# EAGLE design roomba_wall_v2_d (EAGLE 7.6.0)
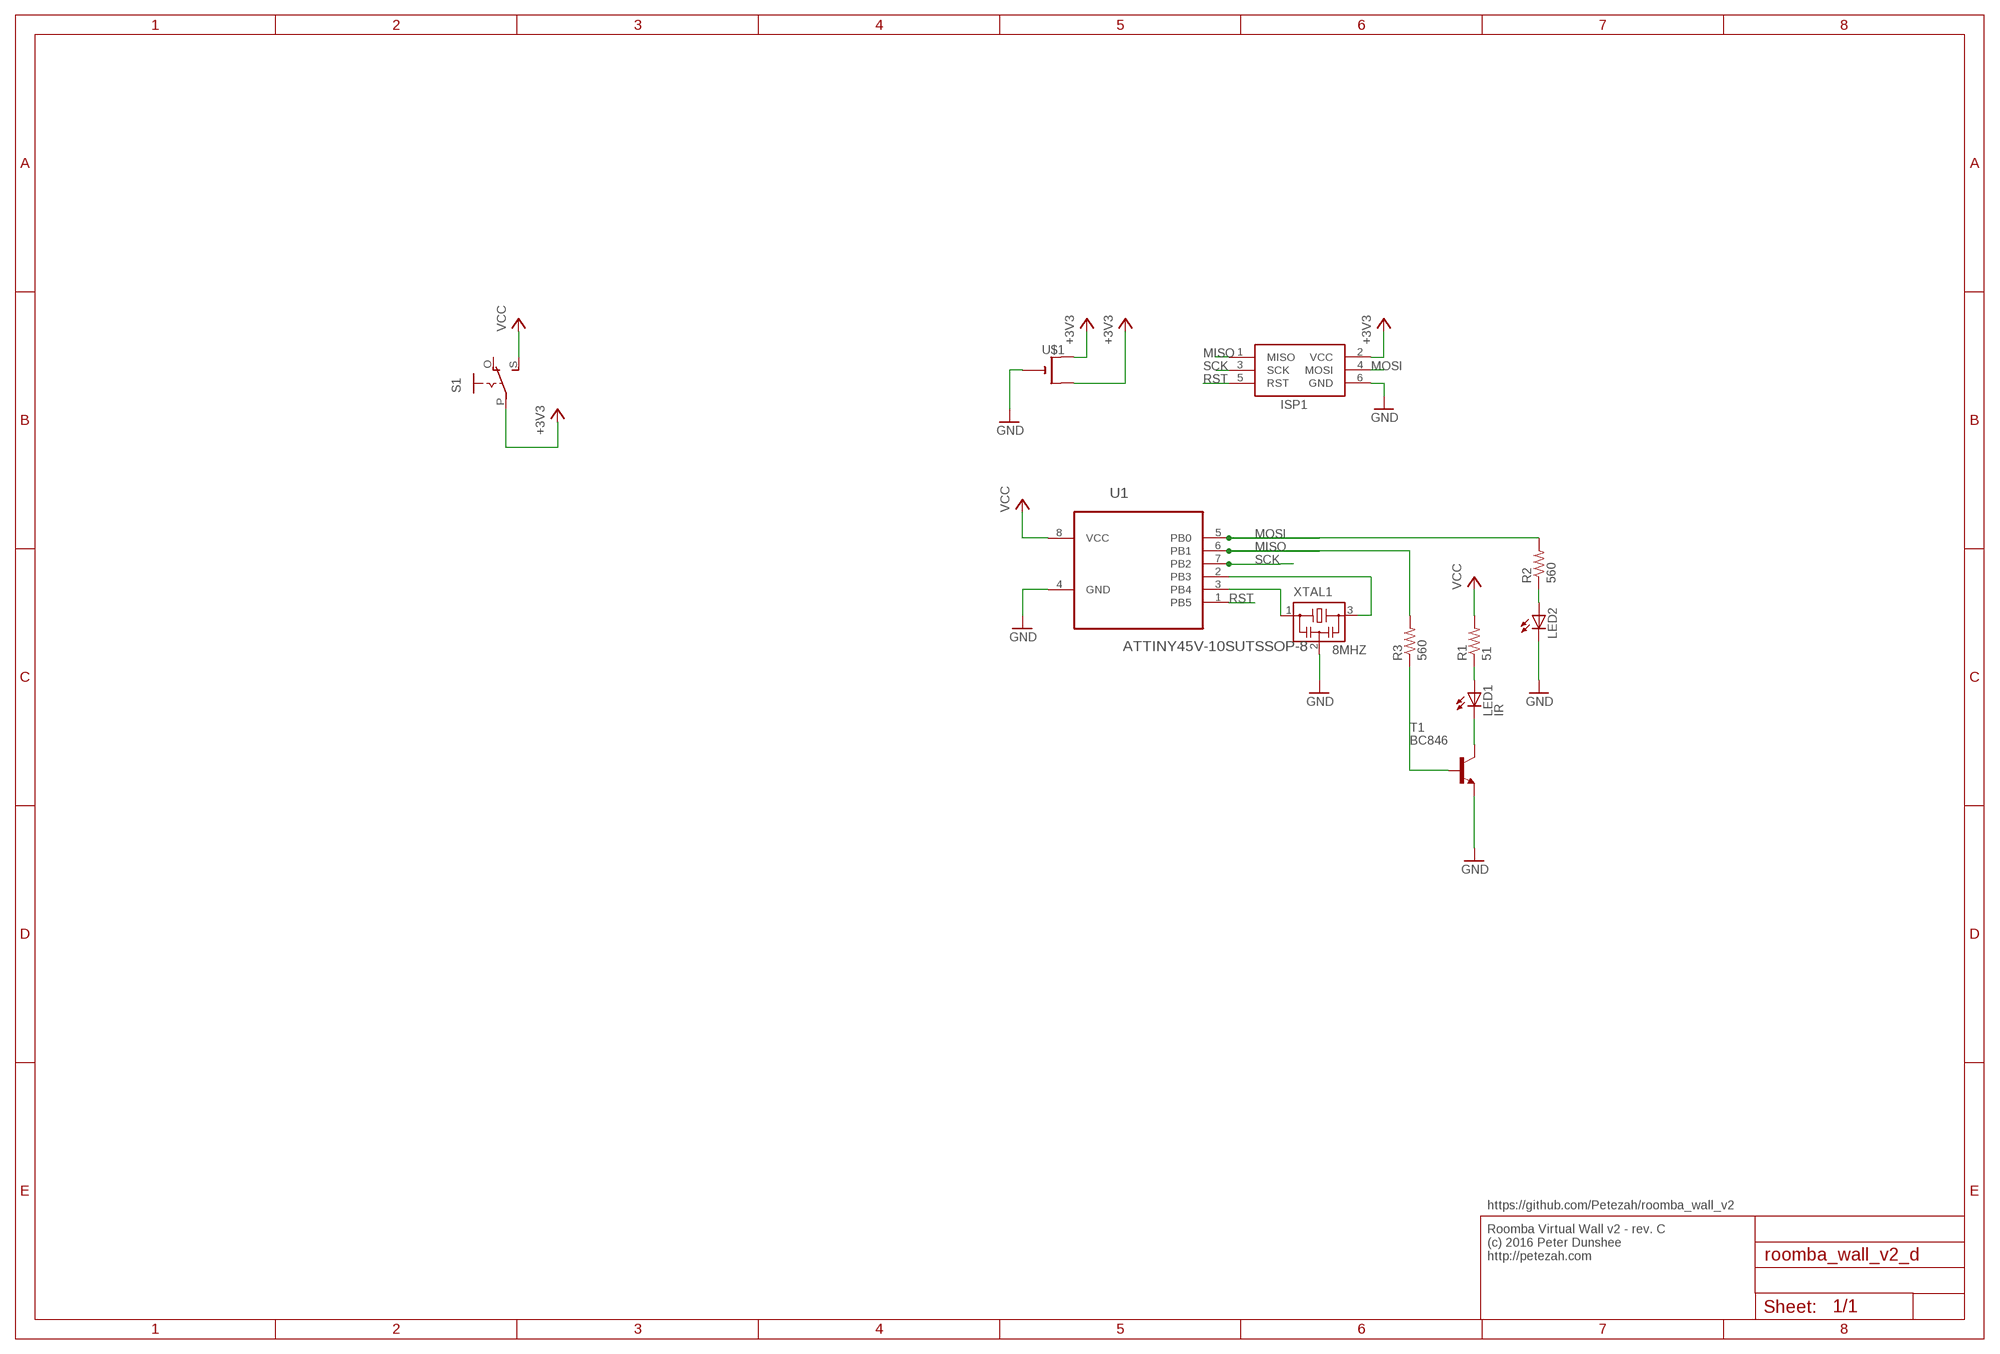
[diagram p0: schematic, sheet 1]

## Parts
ISP1  AVRISP-6  [AVRISP]
LED1  IR  LED3MM  [LED3MM]
LED2  LED3MM  [LED3MM]
R1  51  R-US_R1206  [R1206]
R2  560  R-US_R1206  [R1206]
R3  560  R-US_R1206  [R1206]
S1  EG1218S  [EG1218]
T1  BC846  [SOT23]
U1  ATTINY45V-10SUTSSOP-8  [TSSOP-8]
U$1  CR2032THM  [CR2032-THRU]
XTAL1  8MHZ  CSTCR6M00G53Z  [CSTCR6M]

## Nets
+3V3: ISP1.2(VCC) S1.P U$1.+1(+) U$1.+2(+1)
GND: ISP1.6(GND) LED2.K(C) T1.2(E) U$1.- XTAL1.2
MISO: ISP1.1(MISO) R3.2 U1.6(PB1)
MOSI: ISP1.4(MOSI) R2.2 U1.5(PB0)
N$1: U1.3(PB4) XTAL1.1
N$2: U1.2(PB3) XTAL1.3
N$3: LED1.A R1.1
N$4: LED1.K(C) T1.3(C)
N$5: R3.1 T1.1(B)
N$6: LED2.A R2.1
RST: ISP1.5(RST) U1.1(PB5)
SCK: ISP1.3(SCK) U1.7(PB2)
VCC: R1.2 S1.S
Unconnected: S1.O U1.4(GND)

## Notes on the sheet
- https://github.com/Petezah/roomba_wall_v2
- Roomba Virtual Wall v2 - rev. C
  (c) 2016 Peter Dunshee
  http://petezah.com

## Power pins joined to a net without a drawn wire
VCC: U1.8(VCC)

## Library data of the parts
ISP1 = adafruit:AVRISP: AVR ISP HEADER Standard 6 pin header for AVR programming
LED1 LED2 = adafruit:LED: LED OSRAM: - CHIPLED LG R971, LG N971, LY N971, LG Q971, LY Q971, LO R971, LY R971 LH N974, LH R974 LS Q976, LO Q976, LY Q976 LO Q996 - Hyper CHIPLED LW Q18S LB Q993, LB Q99A, LB R99A - SideLED LS A670, LO A670, LY A670, LG A670, LP A670 LB A673, LV A673, LT A673, LW A673 LH A674 LY A675 LS A676, LA A676, LO A676, LY A676, LW A676 LS A679, LY A679, LG A679 - Hyper Micro SIDELED® LS Y876, LA Y876, LO Y876, LY Y876 LT Y87S - SmartLED LW L88C, LW L88S LB L89C, LB L89S, LG L890 LS L89K, LO L89K, LY L89K LS L896, LA L896, LO L896, LY L896 - TOPLED LS T670, LO T670, LY T670, LG T670, LP T670 LSG T670, LSP T670, LSY T670, LOP T670, LYG T670 LG T671, LOG T671, LSG T671 LB T673, LV T673, LT T673, LW T673 LH T674 LS T676, LA T676, LO T676, LY T676, LB T676, LH T676, LSB T676, LW T676 LB T67C, LV T67C, LT T67C, LS T67K, LO T67K, LY T67K, LW E67C LS E67B, LA E67B, LO E67B, LY E67B, LB E67C, LV E67C, LT E67C LW T67C LS T679, LY T679, LG T679 LS T770, LO T770, LY T770, LG T770, LP T770 LB T773, LV T773, LT T773, LW T773 LH T774 LS E675, LA E675, LY E675, LS T675 LS T776, LA T776, LO T776, LY T776, LB T776 LHGB T686 LT T68C, LB T68C - Hyper Mini TOPLED® LB M676 - Mini TOPLED Santana® LG M470 LS M47K, LO M47K, LY M47K Source: http://www.osram.convergy.de/
R1-R3 = adafruit:R-US_: RESISTOR, American symbol
S1 = adafruit:EG1218: SLIDING SWITCH 0.1" spacing through hole, vertical SPDT slide switch http://www.ladyada.net/library/pcb/eaglelibrary.html
T1 = transistor:BC846: NPN TRANSISTOR
U1 = ATTINY45V-10SU:ATTINY45V-10SU: 8-bit Microcontroller with In-System Programmable Flash
U$1 = adafruit:CR2032
XTAL1 = murata-filter:CSTCR: Resonator Source: murata.co.jp; MPN: CSTCR6M00G53-R0; OC_FARNELL: 1170434; OC_NEWARK: 25M8759

## Board
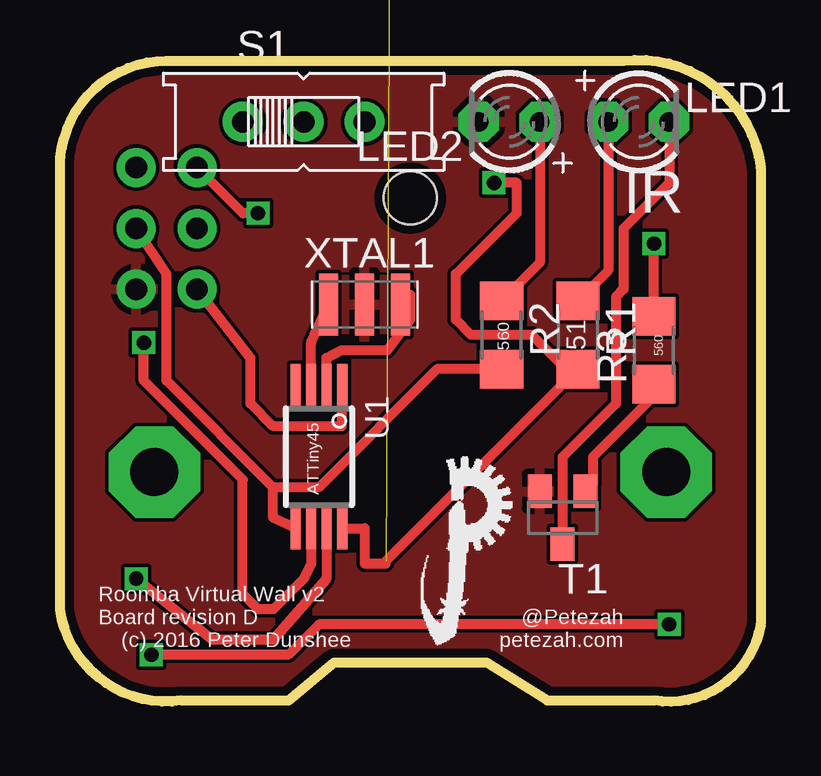
[diagram p1: board, top side]
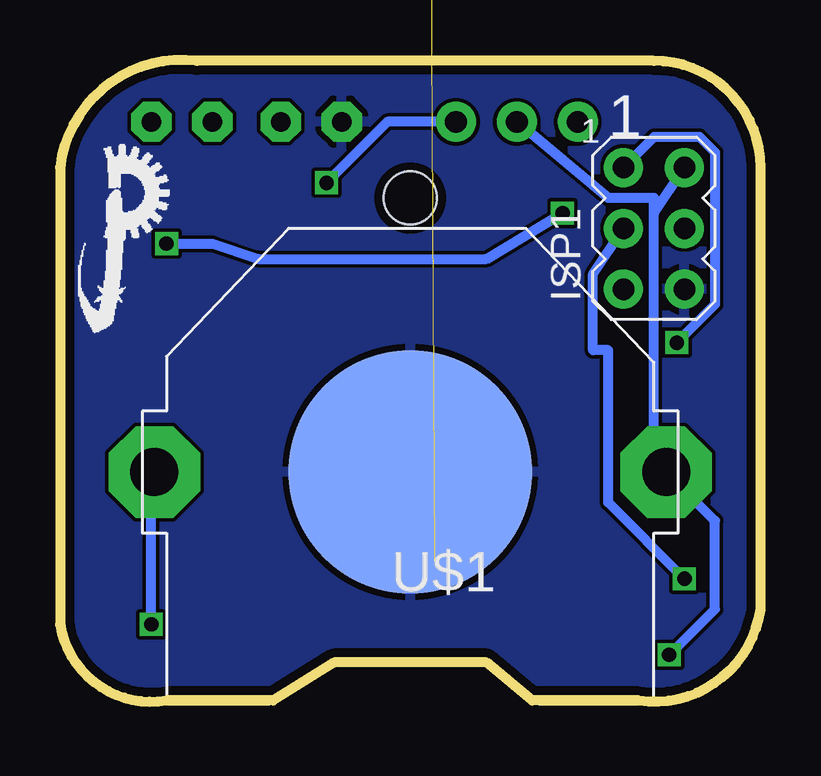
[diagram p2: board, bottom side, seen from below]

Size 29.21 x 26.76 mm. Coordinates in mm from the lower left corner, seen from the top.
Outline: 5.08,0.05 9.53,0.05 11.43,1.64 17.78,1.64 20.32,0.05 24.77,0.05 arc90 29.21,3.23 29.21,22.28 arc90 23.5,26.72 4.45,26.72 arc90 0,22.28 0,3.86 arc90 5.08,0.05
Copper layers (1*16): Top 0.0356mm / dielectric 1.5011mm / Bottom 0.0356mm
Design rules "LaenPCBOrder": minimum track width 6mil, minimum drill 13mil, track to track 6mil, track to pad 6mil, pad to pad 6mil, via to via 6mil, smd to smd 6mil, copper to edge 15mil, drill to drill 6mil, minimum pad ring 7mil, minimum via ring 7mil, stop-mask expansion 3mil, vias tented up to drill 0mil, thermal gap 10mil
Holes 2.2 mm at 14.61,21.01

### Footprints (pad centres in the part's own frame; a part is rotated, then mirrored left to right if it is on the bottom)
AVRISP = drill 0.9 pad 1.626: 1 -1.27,2.54; 2 1.27,2.54; 3 -1.27,0; 4 1.27,0; 5 -1.27,-2.54; 6 1.27,-2.54
LED3MM = drill 0.813 pad 1.676 octagon: A -1.27,0; K 1.27,0
R1206 = smd 1.6 x 1.803: 1 -1.422,0; 2 1.422,0
EG1218 = drill 0.9 pad 1.676: O -2.54,0; P 0,0; S 2.54,0
SOT23 = smd 1 x 1.4: 1 -0.95,-1.1; 2 0.95,-1.1; 3 0,1.1
TSSOP-8 = smd 0.42 x 1.78: 1 -0.975,-2.975; 2 -0.325,-2.975; 3 0.325,-2.975; 4 0.975,-2.975; 5 0.975,2.975; 6 0.325,2.975; 7 -0.325,2.975; 8 -0.975,2.975
CR2032-THRU = drill 2 pad 3.81 octagon: +1 -10.668,0; +2 10.668,0 | smd 10.16 x 10.16: - 0,0
CSTCR6M = smd 0.8 x 2.6: 1 -1.5,0; 2 0,0; 3 1.5,0

### Placement (x,y rotation side)
ISP1  4.45,19.74 0 bottom
LED1  24.13,24.18 0 top
LED2  18.73,24.18 180 top
R1  21.59,15.29 270 top
R2  18.41,15.29 270 top
R3  24.77,14.66 90 top
S1  10.16,24.18 0 top
T1  20.95,7.67 180 top
U1  10.79,10.21 180 top
U$1  14.61,9.58 180 bottom
U$2  [LOGO_TINY]  14.92,2.27 0 top
U$3  [LOGO_TINY]  28.57,15.29 0 bottom
XTAL1  12.7,16.56 0 top

### Tracks (layer width: path | path; a pad name or v marks a point on that pad's centre or on a via)
+3V3  (via drill 0.6)
  Top 0.406: U$1.+2 25.4,9.58 | v25.4,3.23 10.79,3.23 9.53,1.96 v3.81,1.96
  Bottom 0.406: 4.45,20.37 4.45,9.58 U$1.+1 1.91,7.54 1.91,3.86 v3.81,1.96 | 4.45,20.37 ISP1.2 | 4.45,20.37 4.45,21.01 6.35,21.01 S1.P | v25.4,3.23 25.4,9.45 U$1.+2
GND
  pour Bottom: 0,26.72 29.21,26.72 29.21,0.05 20.32,0.05 17.78,1.64 11.43,1.64 9.53,0.05 0,0.05
  pour Top: 0,26.72 29.21,26.72 29.21,0.05 20.32,0.05 17.78,1.64 11.43,1.64 9.53,0.05 0,0.05
MISO  (via drill 0.6)
  Top 0.406: v3.49,14.97 3.49,13.39 7.62,9.26 7.62,4.5 8.26,3.86 8.89,3.86 10.16,5.13 10.48,5.77 U1.6 | R3.2 v24.77,19.1 | v8.26,20.37 7.62,20.37 ISP1.1
  Bottom 0.406: v24.77,19.1 22.86,19.1 20.95,18.47 11.43,18.47 v8.26,20.37 | ISP1.1 4.45,23.55 2.54,23.55 1.91,22.91 1.91,16.56 v3.49,14.97
MOSI
  Top 0.406: 8.89,8.94 4.45,13.39 4.45,17.83 ISP1.4 | R2.2 15.72,13.87 10.79,8.94 8.89,8.94 | U1.5 8.89,7.67 8.89,8.94
N$1
  Top 0.406: U1.3 10.48,14.97 XTAL1.1
N$2
  Top 0.406: XTAL1.3 14.61,16.97 14.61,15.93 13.65,14.66 11.75,14.66 11.11,14.34 U1.2
N$3
  Top 0.406: LED1.A 22.86,17.98 R1.1
N$4
  Top 0.406: LED1.K 25.4,21.64 23.5,19.74 23.5,17.2 23.18,16.88 23.18,12.43 20.95,10.21 T1.3
N$5
  Top 0.406: R3.1 24.77,12.75 22.22,10.21 22.22,9.09 T1.1
N$6
  Top 0.406: LED2.A 20,18.3 R2.1
RST
  Top 0.406: ISP1.5 7.94,14.34 7.94,12.43 8.89,11.48 11.75,11.48 U1.1
SCK  (via drill 0.6)
  Top 0.406: v3.17,5.13 6.35,2.59 8.89,2.59 11.11,5.13 U1.7
  Bottom 0.406: v3.17,5.13 6.35,8.31 6.35,14.66 6.98,14.66 6.98,17.83 ISP1.3
VCC  (via drill 0.6)  (1 unrouted)
  Top 0.406: v18.1,21.64 19.05,21.64 19.05,20.37 16.51,17.83 16.51,15.93 17.14,15.29 19.68,15.29 20.95,14.02 21.59,14.02 R1.2 13.59,5.87 13.59,5.77 12.7,5.77 12.7,7.24 U1.8
  Bottom 0.406: S1.S 15.56,24.18 v18.1,21.64

### Text on the board
tPlace: IR | 560 | 51 | 560 | ATTiny45 | @Petezah / petezah.com | Roomba Virtual Wall v2 / Board revision D | (c) 2016 Peter Dunshee
bPlace: 1